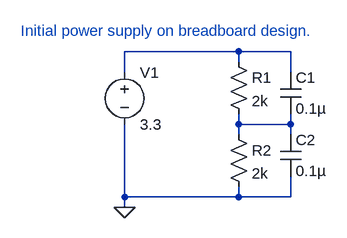
[diagram p0: schematic capstone_divider_supply.asc]
capstone_divider_supply.asc, the LTspice schematic file:
Version 4
SHEET 1 880 680
WIRE 128 32 -48 32
WIRE 208 32 128 32
WIRE 128 48 128 32
WIRE -48 64 -48 32
WIRE 208 64 208 32
WIRE 128 144 128 128
WIRE 208 144 208 128
WIRE 208 144 128 144
WIRE 128 160 128 144
WIRE 208 160 208 144
WIRE -48 256 -48 144
WIRE 128 256 128 240
WIRE 128 256 -48 256
WIRE 208 256 208 224
WIRE 208 256 128 256
WIRE -48 272 -48 256
FLAG -48 272 0
SYMBOL voltage -48 48 R0
SYMATTR InstName V1
SYMATTR Value 3.3
SYMBOL res 112 32 R0
SYMATTR InstName R1
SYMATTR Value 2k
SYMBOL res 112 144 R0
SYMATTR InstName R2
SYMATTR Value 2k
SYMBOL cap 192 64 R0
SYMATTR InstName C1
SYMATTR Value 0.1µ
SYMBOL cap 192 160 R0
SYMATTR InstName C2
SYMATTR Value 0.1µ
TEXT -208 0 Left 2 ;Initial power supply on breadboard design.

The netlist it stands for:
* capstone_divider_supply.asc
V1 N001 0 3.3
R1 N001 N002 2k
R2 N002 0 2k
C1 N001 N002 0.1µ
C2 N002 0 0.1µ
* Initial power supply on breadboard design.
.backanno
.end